# Altium schematic sheet SLED.SchDoc
size A4
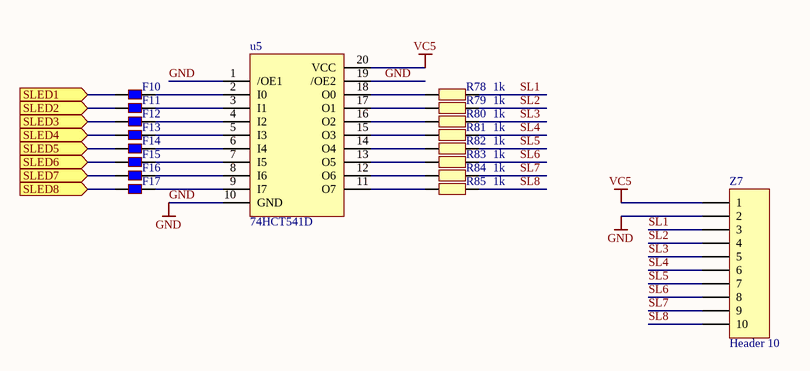
[diagram p0: SLED.SchDoc]

## Parts
F10  BLM18BB141SN1D  [0805L]  (value not drawn)
F11  BLM18BB141SN1D  [0805L]  (value not drawn)
F12  BLM18BB141SN1D  [0805L]  (value not drawn)
F13  BLM18BB141SN1D  [0805L]  (value not drawn)
F14  BLM18BB141SN1D  [0805L]  (value not drawn)
F15  BLM18BB141SN1D  [0805L]  (value not drawn)
F16  BLM18BB141SN1D  [0805L]  (value not drawn)
F17  BLM18BB141SN1D  [0805L]  (value not drawn)
R78  1k  [0805R]
R79  1k  [0805R]
R80  1k  [0805R]
R81  1k  [0805R]
R82  1k  [0805R]
R83  1k  [0805R]
R84  1k  [0805R]
R85  1k  [0805R]
u5  74HCT541D  [SMD20]
Z7  Header 10  [ARC-L-10-3.5]

## Ports
SLED1 (in), SLED2 (in), SLED3 (in), SLED4 (in), SLED5 (in), SLED6 (in), SLED7 (in), SLED8 (in)

## Nets
GND: u5.1(/OE1) u5.10(GND) u5.19(/OE2) Z7.2
VC5: u5.20(VCC) Z7.1
SL1: R78.2 Z7.3
SL2: R79.2 Z7.4
SL3: R80.2 Z7.5
SL4: R81.2 Z7.6
SL5: R82.2 Z7.7
SL6: R83.2 Z7.8
SL7: R84.2 Z7.9
SL8: R85.2 Z7.10
SLED1: F10.2 ; port SLED1
SLED2: F11.2 ; port SLED2
SLED3: F12.2 ; port SLED3
SLED4: F13.2 ; port SLED4
SLED5: F14.2 ; port SLED5
SLED6: F15.2 ; port SLED6
SLED7: F16.2 ; port SLED7
SLED8: F17.2 ; port SLED8
NetF10_1: F10.1 u5.2(I0)
NetF11_1: F11.1 u5.3(I1)
NetF12_1: F12.1 u5.4(I2)
NetF13_1: F13.1 u5.5(I3)
NetF14_1: F14.1 u5.6(I4)
NetF15_1: F15.1 u5.7(I5)
NetF16_1: F16.1 u5.8(I6)
NetF17_1: F17.1 u5.9(I7)
NetR78_1: R78.1 u5.18(O0)
NetR79_1: R79.1 u5.17(O1)
NetR80_1: R80.1 u5.16(O2)
NetR81_1: R81.1 u5.15(O3)
NetR82_1: R82.1 u5.14(O4)
NetR83_1: R83.1 u5.13(O5)
NetR84_1: R84.1 u5.12(O6)
NetR85_1: R85.1 u5.11(O7)

## Library data of the parts
F10-F17 = KORALIK: Koralik ferrytowy
R78-R85 = RES3
u5 = 74541
Z7 = Header 10: Header, 10-Pin; LatestRevisionDate: 17-Jul-2002; LatestRevisionNote: Re-released for DXP Platform.; Publisher: Altium Limited